# Altium project PCA_0005_FULL_CB_REV_B.PrjPcb
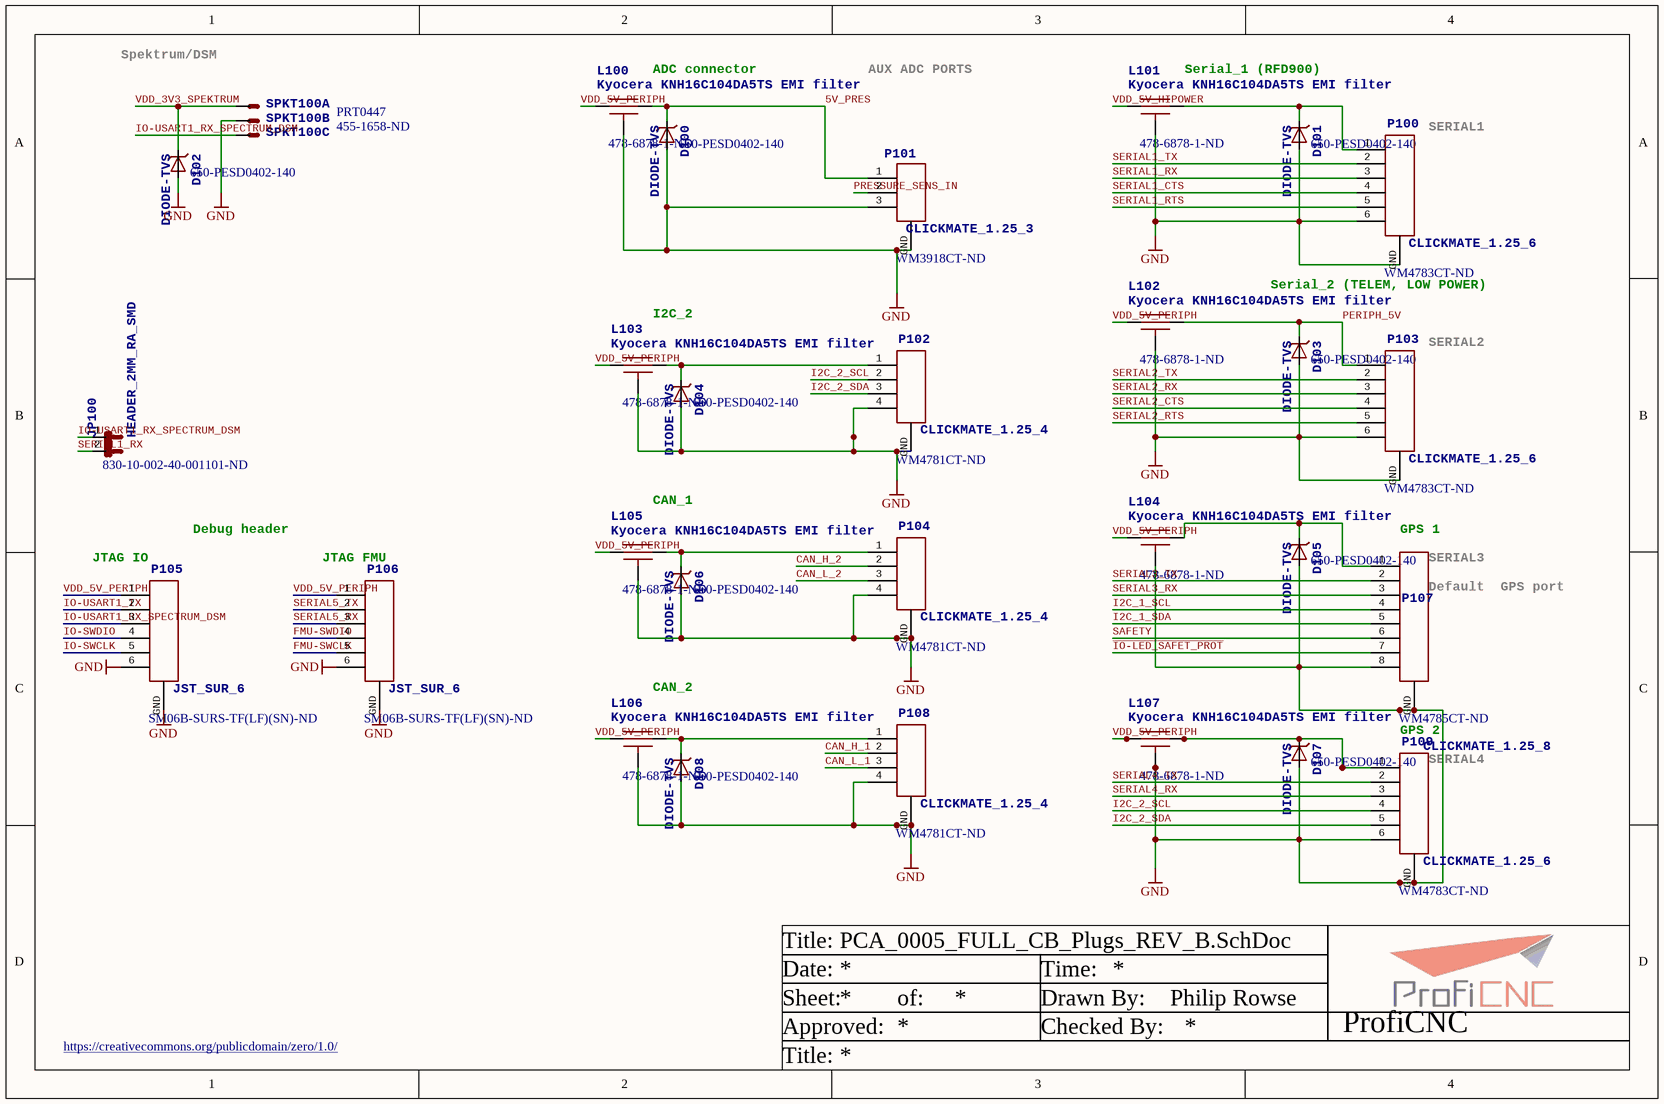
[diagram p0: PCA_0005_FULL_CB_Plugs_REV_B.SchDoc]
6 sheets, 108 parts. Net scope: global (net labels, ports and power ports of the same name join across sheets).
Board file: PCA_0005_FULL_CB_REV_B.PcbDoc
Sheets:
  PCA_0005_FULL_CB_Plugs_REV_B.SchDoc
  PCA_0005_FULL_CB_Power_REV_B.SchDoc
  PCA_0005_FULL_CB_INTEL_REV_B.SchDoc
  PCA_0005_FULL_CB_Servo_REV_B.SchDoc
  PCA_0005_FULL_CB_tp_REV_B.SchDoc
  PCA_0005_FULL_CB_80_Pin_REV_B.SchDoc

## Sheet PCA_0005_FULL_CB_Plugs_REV_B.SchDoc
size A4; DrawnBy: Philip Rowse

### Parts
D100  DIODE-TVS  Supplier Part Number 1: 650-PESD0402-140  [0402-TVS]
D101  DIODE-TVS  Supplier Part Number 1: 650-PESD0402-140  [0402-TVS]
D102  DIODE-TVS  Supplier Part Number 1: 650-PESD0402-140  [0402-TVS]
D103  DIODE-TVS  Supplier Part Number 1: 650-PESD0402-140  [0402-TVS]
D104  DIODE-TVS  Supplier Part Number 1: 650-PESD0402-140  [0402-TVS]
D105  DIODE-TVS  Supplier Part Number 1: 650-PESD0402-140  [0402-TVS]
D106  DIODE-TVS  Supplier Part Number 1: 650-PESD0402-140  [0402-TVS]
D107  DIODE-TVS  Supplier Part Number 1: 650-PESD0402-140  [0402-TVS]
D108  DIODE-TVS  Supplier Part Number 1: 650-PESD0402-140  [0402-TVS]
JP100  HEADER_2MM_RA_SMD  Supplier Part Number 1: 830-10-002-40-001101-ND  [HEADER_2MM_RA_2]
L100  Kyocera KNH16C104DA5TS EMI filter  Supplier Part Number 1: 478-6878-1-ND  [KYOCERA-KNH16-DA]
L101  Kyocera KNH16C104DA5TS EMI filter  Supplier Part Number 1: 478-6878-1-ND  [KYOCERA-KNH16-DA]
L102  Kyocera KNH16C104DA5TS EMI filter  Supplier Part Number 1: 478-6878-1-ND  [KYOCERA-KNH16-DA]
L103  Kyocera KNH16C104DA5TS EMI filter  Supplier Part Number 1: 478-6878-1-ND  [KYOCERA-KNH16-DA]
L104  Kyocera KNH16C104DA5TS EMI filter  Supplier Part Number 1: 478-6878-1-ND  [KYOCERA-KNH16-DA]
L105  Kyocera KNH16C104DA5TS EMI filter  Supplier Part Number 1: 478-6878-1-ND  [KYOCERA-KNH16-DA]
L106  Kyocera KNH16C104DA5TS EMI filter  Supplier Part Number 1: 478-6878-1-ND  [KYOCERA-KNH16-DA]
L107  Kyocera KNH16C104DA5TS EMI filter  Supplier Part Number 1: 478-6878-1-ND  [KYOCERA-KNH16-DA]
P100  CLICKMATE_1.25_6  Supplier Part Number 1: WM4783CT-ND  [CLICKMATE_V6]
P101  CLICKMATE_1.25_3  Supplier Part Number 1: WM3918CT-ND  [CLICKMATE_V3]
P102  CLICKMATE_1.25_4  Supplier Part Number 1: WM4781CT-ND  [CLICKMATE_V4]
P103  CLICKMATE_1.25_6  Supplier Part Number 1: WM4783CT-ND  [CLICKMATE_V6]
P104  CLICKMATE_1.25_4  Supplier Part Number 1: WM4781CT-ND  [CLICKMATE_V4]
P105  JST_SUR_6  Supplier Part Number 1: SM06B-SURS-TF(LF)(SN)-ND  [JST_SUR_H6]
P106  JST_SUR_6  Supplier Part Number 1: SM06B-SURS-TF(LF)(SN)-ND  [JST_SUR_H6]
P107  CLICKMATE_1.25_8  Supplier Part Number 1: WM4785CT-ND  [CLICKMATE_V8]
P108  CLICKMATE_1.25_4  Supplier Part Number 1: WM4781CT-ND  [CLICKMATE_V4]
P109  CLICKMATE_1.25_6  Supplier Part Number 1: WM4783CT-ND  [CLICKMATE_V6]
SPKT100  CONN_SPEKTRUM_RX-TH  [B3B-ZR]  (value not drawn)  (parts A,B,C of 3)

### Nets
GND: D100.A D101.A D102.A D103.A D104.A D105.A D106.A D107.A D108.A L100.GND L101.GND L102.GND L103.GND L104.GND L105.GND L106.GND L107.GND P100.6 P100.GND P101.3 P101.GND P102.4 P102.GND P103.6 P103.GND P104.4 P104.GND P105.6 P105.GND P106.6 P106.GND P107.8 P107.GND P108.4 P108.GND P109.6 P109.GND SPKT100.2(S)
5V_PRES: D100.C L100.P$2 P101.1
CAN_H_1: P108.2
CAN_H_2: P104.2
CAN_L_1: P108.3
CAN_L_2: P104.3
FMU-SWCLK: P106.5
FMU-SWDIO: P106.4
I2C_1_SCL: P107.4
I2C_1_SDA: P107.5
I2C_2_SCL: P102.2 P109.4
I2C_2_SDA: P102.3 P109.5
~{IO-LED_SAFET_PROT}: P107.7
IO-SWCLK: P105.5
IO-SWDIO: P105.4
IO-USART1_RX_SPECTRUM_DSM: JP100.1 P105.3 SPKT100.1(S)
IO-USART1_TX: P105.2
PERIPH_5V: D103.C L102.P$2 P103.1
PRESSURE_SENS_IN: P101.2
SAFETY: P107.6
SERIAL1_CTS: P100.4
SERIAL1_RTS: P100.5
SERIAL1_RX: JP100.2 P100.3
SERIAL1_TX: P100.2
SERIAL2_CTS: P103.4
SERIAL2_RTS: P103.5
SERIAL2_RX: P103.3
SERIAL2_TX: P103.2
SERIAL3_RX: P107.3
SERIAL3_TX: P107.2
SERIAL4_RX: P109.3
SERIAL4_TX: P109.2
SERIAL5_RX: P106.3
SERIAL5_TX: P106.2
VDD_3V3_SPEKTRUM: D102.C SPKT100.3(S)
VDD_5V_HIPOWER: L101.P$1
VDD_5V_PERIPH: L100.P$1 L102.P$1 L103.P$1 L104.P$1 L105.P$1 L106.P$1 L107.P$1 P105.1 P106.1
NetD101_C: D101.C L101.P$2 P100.1
NetD104_C: D104.C L103.P$2 P102.1
NetD105_C: D105.C L104.P$2 P107.1
NetD106_C: D106.C L105.P$2 P104.1
NetD107_C: D107.C L107.P$2 P109.1
NetD108_C: D108.C L106.P$2 P108.1

### Notes on the sheet
- Spektrum/DSM
- (near L100) ADC connector
- AUX ADC PORTS
- (near L101) Serial_1 (RFD900)
- (near P100) SERIAL1
- (near L103) I2C_2
- Serial_2 (TELEM, LOW POWER)
- (near P103) SERIAL2
- Debug header
- (near L105) CAN_1
- (near P107) GPS 1
- (near P105) JTAG IO
- (near P106) JTAG FMU
- (near P107) SERIAL3
- (near P107) Default
  GPS port
- (near L106) CAN_2
- GPS 2
- (near P109) SERIAL4
- Title:
- Date:
- Time:
- https://creativecommons.org/publicdomain/zero/1.0/
- Sheet:
- Approved:
- of:
- Drawn By:
- Checked By:
- ProfiCNC

### Library data of the parts
D100-D108 = DIODE-TVS: Diode, TVS, 14VWM, 40VC, 0402, SMD; 3DR_PARTNO: ECM0837; Supplier 1: Mouser
JP100 = HEADER_2MM_RA_SMD: Connector, PCB, 2MM, 2Pos, R/A, SMD, Au; PARTNO: 830-10-002-40-001101; 3DR_PARTNO: PRT0437; Supplier 1: Digi-Key
L100-L107 = KNH16C104DA5TS: Capacitor, Filter, 0.1uF, 25V, 2A, 0603, SMD; 3DR_PARTNO: ECM0719; Supplier 1: Digi-Key
P100 P103 P109 = CLICKMATE_1.25_6: Connector, Rcpt, 6Pos, 1.25MM, W/B, VERT, SMD, Tin; 3DR_PARTNO: PRT0439; Supplier 1: Digi-Key
P101 = CLICKMATE_1.25_3: Connector, Rcpt,1.25MM,W/B,SGL,S/T,3CKT,SMD,Tin; 3DR_PARTNO: PRT0440; Supplier 1: Digi-Key
P102 P104 P108 = CLICKMATE_1.25_4: Connector, Rcpt, 4Pos, 1.25MM, W/B, VERT, SMD, Tin; 3DR_PARTNO: PRT0441; Supplier 1: Digi-Key
P105 P106 = JST_SUR_6: Connector, Header, 6Pos, .8mm IDC, R/A, SMD, Tin; 3DR_PARTNO: PRT0442; Supplier 1: Digi-Key
P107 = CLICKMATE_1.25_8: Connector, Rcpt, 8Pos, 1.25MM, W/B, VERT, SMD, Tin; 3DR_PARTNO: PRT0443; Supplier 1: Digi-Key
SPKT100 = CONN_SPEKTRUM_RX-TH: Spektrum RX connector; JST ZH series S3B-ZR-SM4A-TF; PARTNO: B3B-ZR(LF)(SN); 3DR_PARTNO: PRT0447

## Sheet PCA_0005_FULL_CB_Power_REV_B.SchDoc
size A4; DrawnBy: Philip Rowse
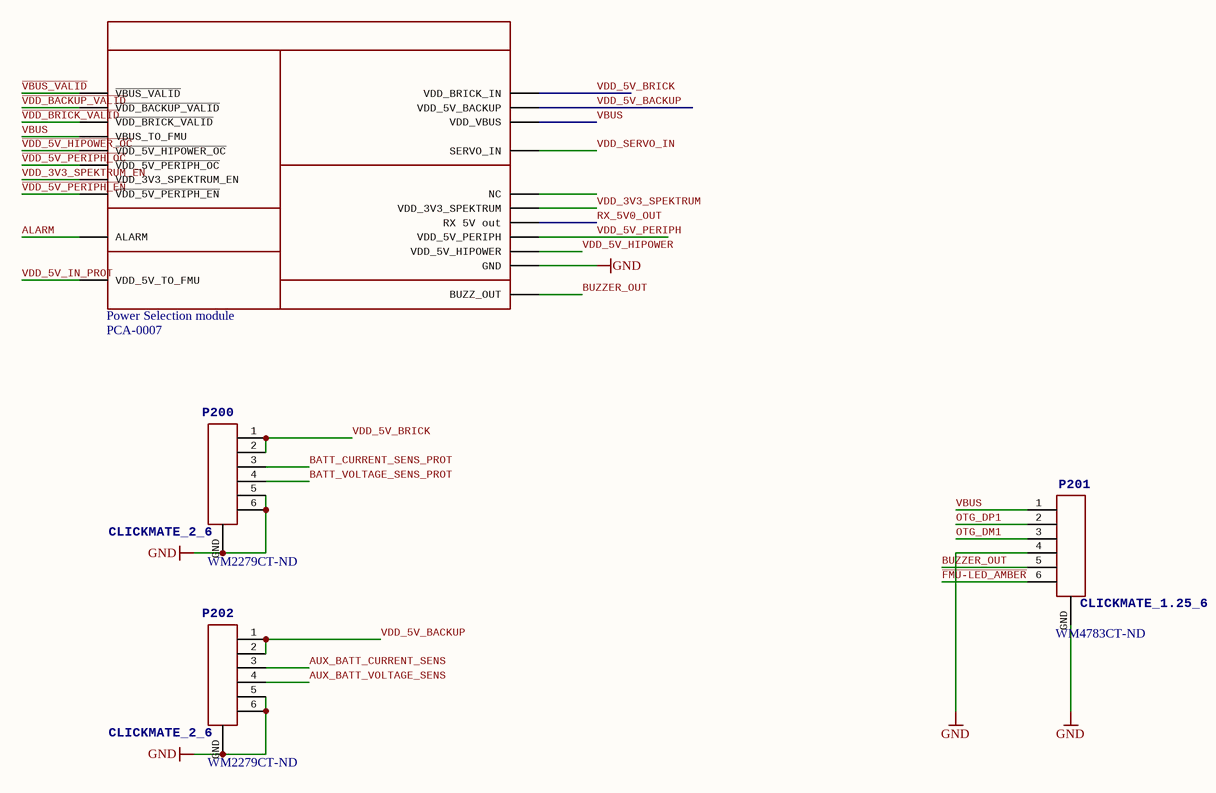
[diagram p1: PCA_0005_FULL_CB_Power_REV_B.SchDoc]

### Parts
P200  CLICKMATE_2_6  Supplier Part Number 1: WM2279CT-ND  [CLICKMATE_V6_2MM]
P201  CLICKMATE_1.25_6  Supplier Part Number 1: WM4783CT-ND  [CLICKMATE_V6]
P202  CLICKMATE_2_6  Supplier Part Number 1: WM2279CT-ND  [CLICKMATE_V6_2MM]
PSM200  Power Selection module  Supplier Part Number 1: PCA-0007  [PSM]

### Nets
GND: P200.5 P200.6 P200.GND P201.4 P201.GND P202.5 P202.6 P202.GND PSM200.GND
ALARM: PSM200.ALARM
AUX_BATT_CURRENT_SENS: P202.3
AUX_BATT_VOLTAGE_SENS: P202.4
BATT_CURRENT_SENS_PROT: P200.3
BATT_VOLTAGE_SENS_PROT: P200.4
BUZZER_OUT: P201.5 PSM200.BUZZER_OUT(BUZZ_OUT)
~{FMU-LED_AMBER}: P201.6
OTG_DM1: P201.3
OTG_DP1: P201.2
RX_5V0_OUT: PSM200.RX(RX_5V_out)
~{VBUS_VALID}: PSM200.!VBUS_VALID(~{VBUS_VALID})
~{VDD_5V_HIPOWER_OC}: PSM200.!VDD_5V_HIPOWER_OC(~{VDD_5V_HIPOWER_OC})
~{VDD_5V_PERIPH_EN}: PSM200.!VDD_5V_PERIPH_EN(~{VDD_5V_PERIPH_EN})
~{VDD_5V_PERIPH_OC}: PSM200.!VDD_5V_PERIPH_OC(~{VDD_5V_PERIPH_OC})
~{VDD_BACKUP_VALID}: PSM200.!VDD_BACKUP_VALID(~{VDD_BACKUP_VALID})
~{VDD_BRICK_VALID}: PSM200.!VDD_BRICK_VALID(~{VDD_BRICK_VALID})
VBUS: P201.1 PSM200.VBUS(VBUS_TO_FMU) PSM200.VDD_VBUS
VDD_3V3_SPEKTRUM: PSM200.SPEK(VDD_3V3_SPEKTRUM)
VDD_3V3_SPEKTRUM_EN: PSM200.VDD_3V3_SPEKTRUM_EN
VDD_5V_BACKUP: P202.1 P202.2 PSM200.VDD_5V_BACKUP
VDD_5V_BRICK: P200.1 P200.2 PSM200.VDD_BRICK_IN
VDD_5V_HIPOWER: PSM200.5V_HIPOWER(VDD_5V_HIPOWER)
VDD_5V_IN_PROT: PSM200.VDD_5V_IN_PROT(VDD_5V_TO_FMU)
VDD_5V_PERIPH: PSM200.5V_PERIPH(VDD_5V_PERIPH)
VDD_SERVO_IN: PSM200.SERVO_IN

Not connected (* = marked no-connect by the designer): PSM200 NC

### Notes on the sheet
- Title:
- Date:
- Time:
- https://creativecommons.org/publicdomain/zero/1.0/
- Sheet:
- Approved:
- of:
- Drawn By:
- Checked By:
- ProfiCNC

### Library data of the parts
P200 P202 = CLICKMATE_2_6: Connector, Header, 6Pos, 2.54MM, Vert, THT, Au; 3DR_PARTNO: PRT0445; Supplier 1: Digi-Key
P201 = CLICKMATE_1.25_6: as P100 on sheet PCA_0005_FULL_CB_Plugs_REV_B; Supplier 1: Digi-Key
PSM200 = PSMPSM: PCA, PSM, PX4, Assembly; Manufacturer 1: 3DR; Mfg Part Num (Alternate): DO NOT SWAP; 3DR_PARTNO: PCA0007; Supplier 1: 3DR; Supplier Unit Price 1: 17; Manufacturer Part Number 1: PCA-0007; Supplier Currency 1: USD; Supplier Order Qty 1: 100

## Sheet PCA_0005_FULL_CB_INTEL_REV_B.SchDoc
size A4; DrawnBy: Philip Rowse
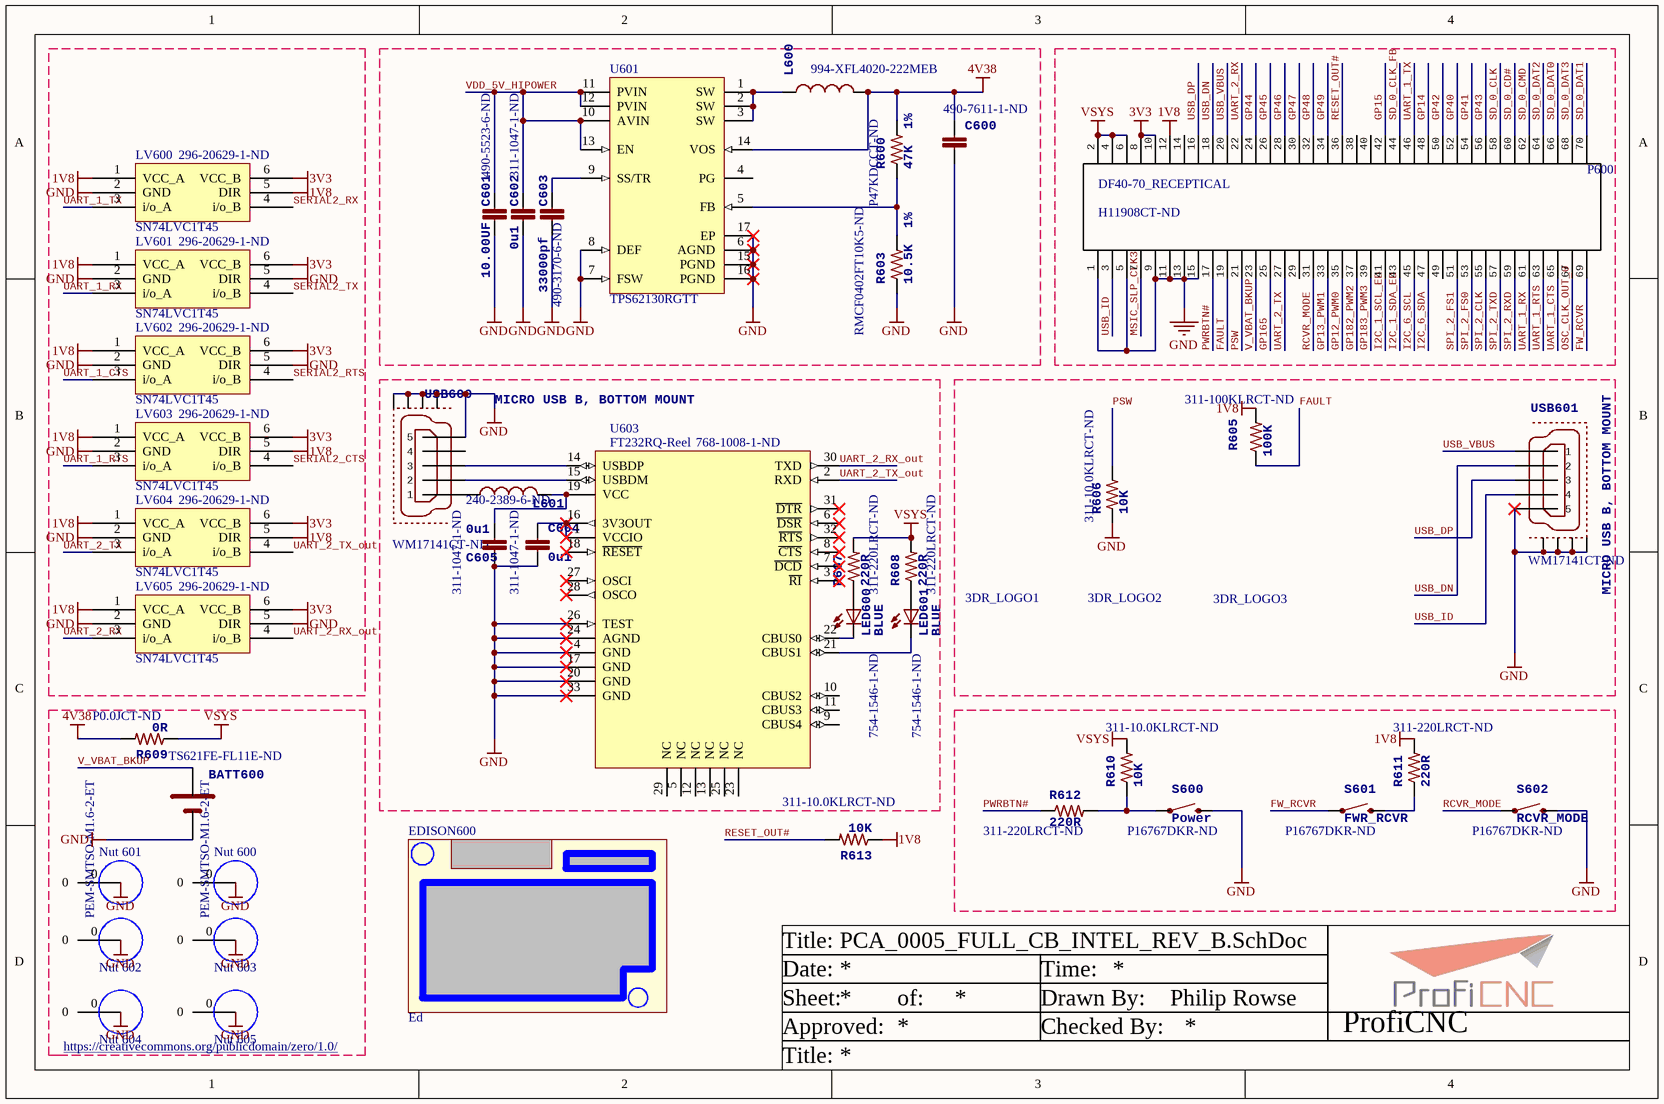
[diagram p2: PCA_0005_FULL_CB_INTEL_REV_B.SchDoc]

### Parts
3DR_LOGO1  (no value)  [3DR_Small]
3DR_LOGO2  (no value)  [3DR_smaller]
3DR_LOGO3  (no value)  [3DR_smaller]
BATT600  Supplier Part Number 1: TS621FE-FL11E-ND  [MS621FE]
C600  Supplier Part Number 1: 490-7611-1-ND  [0603-CAP]
C601  10.00UF  Supplier Part Number 1: 490-5523-6-ND  [0805-CAP]
C602  0u1  Supplier Part Number 1: 311-1047-1-ND  [0402-CAP]
C603  33000pf  Supplier Part Number 1: 490-3170-6-ND  [0402-CAP]
C604  0u1  Supplier Part Number 1: 311-1047-1-ND  [0402-CAP]
C605  0u1  Supplier Part Number 1: 311-1047-1-ND  [0402-CAP]
EDISON600  Ed  [ed]
L600  Supplier Part Number 1: 994-XFL4020-222MEB  [XFL4020]  (hidden comment: XFL4020-222MEB)
L601  Supplier Part Number 1: 240-2389-6-ND  [0805-IND]
LED600  BLUE  Supplier Part Number 1: 754-1546-1-ND  [0603-LED-Blue]
LED601  BLUE  Supplier Part Number 1: 754-1546-1-ND  [0603-LED-Blue]
LV600  SN74LVC1T45  Supplier Part Number 1: 296-20629-1-ND  [DRL]
LV601  SN74LVC1T45  Supplier Part Number 1: 296-20629-1-ND  [DRL]
LV602  SN74LVC1T45  Supplier Part Number 1: 296-20629-1-ND  [DRL]
LV603  SN74LVC1T45  Supplier Part Number 1: 296-20629-1-ND  [DRL]
LV604  SN74LVC1T45  Supplier Part Number 1: 296-20629-1-ND  [DRL]
LV605  SN74LVC1T45  Supplier Part Number 1: 296-20629-1-ND  [DRL]
Nut_600  PEM-SMTSO-M1.6-2-ET  [PEM-SMTSO-M1.6-2-ET]
Nut_601  PEM-SMTSO-M1.6-2-ET  [PEM-SMTSO-M1.6-2-ET]
Nut_602  PEM-SMTSO-M1.6-2-ET  [PEM-SMTSO-M1.6-2-ET]  (value not drawn)
Nut_603  PEM-SMTSO-M1.6-2-ET  [PEM-SMTSO-M1.6-2-ET]  (value not drawn)
Nut_604  PEM-SMTSO-M1.6-2-ET  [PEM-SMTSO-M1.6-2-ET]  (value not drawn)
Nut_605  PEM-SMTSO-M1.6-2-ET  [PEM-SMTSO-M1.6-2-ET]  (value not drawn)
P600  DF40-70_RECEPTICAL  Supplier Part Number 1: H11908CT-ND  [DF40-70_RECEPTICAL]
R600  47K  1%  Supplier Part Number 1: P47KDCCT-ND  [0402-RES]
R603  10.5K  1%  Supplier Part Number 1: RMCF0402FT10K5-ND  [0402-RES]
R605  100K  Supplier Part Number 1: 311-100KLRCT-ND  [0402-RES]
R606  10K  Supplier Part Number 1: 311-10.0KLRCT-ND  [0402-RES]
R607  220R  Supplier Part Number 1: 311-220LRCT-ND  [0402-RES]
R608  220R  Supplier Part Number 1: 311-220LRCT-ND  [0402-RES]
R609  0R  Supplier Part Number 1: P0.0JCT-ND  [0402-RES]
R610  10K  Supplier Part Number 1: 311-10.0KLRCT-ND  [0402-RES]
R611  220R  Supplier Part Number 1: 311-220LRCT-ND  [0402-RES]
R612  220R  Supplier Part Number 1: 311-220LRCT-ND  [0402-RES]
R613  10K  Supplier Part Number 1: 311-10.0KLRCT-ND  [0402-RES]
S600  Power  Supplier Part Number 1: P16767DKR-ND  [EVQP7J01K]
S601  FWR_RCVR  Supplier Part Number 1: P16767DKR-ND  [EVQP7J01K]
S602  RCVR_MODE  Supplier Part Number 1: P16767DKR-ND  [EVQP7J01K]
U601  TPS62130RGTT  [RGT16-1700X1700TP]
U603  FT232RQ-Reel  Supplier Part Number 1: 768-1008-1-ND  [PQFN5X5-32_V]
USB600  MICRO USB B, BOTTOM MOUNT  Supplier Part Number 1: WM17141CT-ND  [MOLEX-47346-0001]
USB601  MICRO USB B, BOTTOM MOUNT  Supplier Part Number 1: WM17141CT-ND  [MOLEX-47346-0001]

### Nets
1V8: LV600.1(VCC_A) LV600.5(DIR) LV601.1(VCC_A) LV602.1(VCC_A) LV603.1(VCC_A) LV603.5(DIR) LV604.1(VCC_A) LV604.5(DIR) LV605.1(VCC_A) P600.12(P$12) R605.P$2 R611.P$2 R613.P$1
3V3: LV600.6(VCC_B) LV601.6(VCC_B) LV602.6(VCC_B) LV603.6(VCC_B) LV604.6(VCC_B) LV605.6(VCC_B) P600.8(P$8) P600.10(P$10)
4V38: C600.P$1 L600.P$2 R600.P$2 R609.P$2 U601.14(VOS)
GND: BATT600.2(NEG) C600.P$2 C601.P$2 C602.P$2 C603.P$2 C604.P$2 C605.P$2 LV600.2(GND) LV601.2(GND) LV601.5(DIR) LV602.2(GND) LV602.5(DIR) LV603.2(GND) LV604.2(GND) LV605.2(GND) LV605.5(DIR) Nut_600.0 Nut_601.0 Nut_602.0 Nut_603.0 Nut_604.0 Nut_605.0 P600.1(P$1) P600.5(P$5) P600.9(P$9) P600.11(P$11) P600.13(P$13) P600.15(P$15) R603.P$1 R606.P$1 S600.B3 S602.B3 U601.6(AGND) U601.7(FSW) U601.8(DEF) U601.15(PGND) U601.16(PGND) U601.17(EP) U603.4(GND) U603.17(GND) U603.20(GND) U603.24(AGND) U603.26(TEST) U603.33(GND) USB600.GND(5) USB600.GND1 USB600.GND2 USB600.GND3 USB600.GND4 USB601.GND(5) USB601.GND1 USB601.GND2 USB601.GND3 USB601.GND4
VSYS: P600.2(P$2) P600.4(P$4) P600.6(P$6) R607.P$2 R608.P$2 R609.P$1 R610.P$2
FAULT: P600.19(P$19) R605.P$1
FW_RCVR: P600.69(P$69) S601.A1
GP12_PWM0: P600.35(P$35)
GP13_PWM1: P600.33(P$33)
GP14: P600.48(P$48)
GP15: P600.42(P$42)
GP40: P600.52(P$52)
GP41: P600.54(P$54)
GP42: P600.50(P$50)
GP43: P600.56(P$56)
GP44: P600.24(P$24)
GP45: P600.26(P$26)
GP46: P600.28(P$28)
GP47: P600.30(P$30)
GP48: P600.32(P$32)
GP49: P600.34(P$34)
GP165: P600.25(P$25)
GP182_PWM2: P600.37(P$37)
GP183_PWM3: P600.39(P$39)
I2C_1_SCL_ED: P600.41(P$41)
I2C_1_SDA_ED: P600.43(P$43)
I2C_6_SCL: P600.45(P$45)
I2C_6_SDA: P600.47(P$47)
MSIC_SLP_CLK3: P600.7(P$7)
OSC_CLK_OUT_0: P600.67(P$67)
PSW: P600.21(P$21) R606.P$2
PWRBTN#: P600.17(P$17) R612.P$1
RCVR_MODE: P600.31(P$31) S602.A1
RESET_OUT#: P600.36(P$36) R613.P$2
SD_0_CD#: P600.60(P$60)
SD_0_CLK: P600.58(P$58)
SD_0_CLK_FB: P600.44(P$44)
SD_0_CMD: P600.62(P$62)
SD_0_DAT0: P600.66(P$66)
SD_0_DAT1: P600.70(P$70)
SD_0_DAT2: P600.64(P$64)
SD_0_DAT3: P600.68(P$68)
SERIAL2_CTS: LV603.4(i/o_B)
SERIAL2_RTS: LV602.4(i/o_B)
SERIAL2_RX: LV600.4(i/o_B)
SERIAL2_TX: LV601.4(i/o_B)
SPI_2_CLK: P600.55(P$55)
SPI_2_FS0: P600.53(P$53)
SPI_2_FS1: P600.51(P$51)
SPI_2_RXD: P600.59(P$59)
SPI_2_TXD: P600.57(P$57)
UART_1_CTS: LV602.3(i/o_A) P600.65(P$65)
UART_1_RTS: LV603.3(i/o_A) P600.63(P$63)
UART_1_RX: LV601.3(i/o_A) P600.61(P$61)
UART_1_TX: LV600.3(i/o_A) P600.46(P$46)
UART_2_RX: LV605.3(i/o_A) P600.22(P$22)
UART_2_RX_out: LV605.4(i/o_B) U603.30(TXD)
UART_2_TX: LV604.3(i/o_A) P600.27(P$27)
UART_2_TX_out: LV604.4(i/o_B) U603.2(RXD)
USB_DN: P600.18(P$18) USB601.D-(2)
USB_DP: P600.16(P$16) USB601.D+(3)
USB_ID: P600.3(P$3) USB601.ID(4)
USB_VBUS: P600.20(P$20) USB601.VBUS(1)
V_VBAT_BKUP: BATT600.1(POS) P600.23(P$23)
VDD_5V_HIPOWER: C601.P$1 C602.P$1 U601.10(AVIN) U601.11(PVIN) U601.12(PVIN) U601.13(EN)
NetC603_P$1: C603.P$1 U601.9(SS/TR)
NetC604_P$1: C604.P$1 U603.1(VCCIO) U603.16(3V3OUT)
NetC605_P$1: C605.P$1 L601.P$2 U603.19(VCC)
NetL600_P$1: L600.P$1 U601.1(SW) U601.2(SW) U601.3(SW)
NetL601_P$1: L601.P$1 USB600.VBUS(1)
NetLED600_A: LED600.A R607.P$1
NetLED600_C: LED600.C U603.22(CBUS0)
NetLED601_A: LED601.A R608.P$1
NetLED601_C: LED601.C U603.21(CBUS1)
NetR600_P$1: R600.P$1 R603.P$2 U601.5(FB)
NetR610_P$1: R610.P$1 R612.P$2 S600.A1
NetR611_P$1: R611.P$1 S601.B3
NetU603_14: U603.14(USBDP) USB600.D+(3)
NetU603_15: U603.15(USBDM) USB600.D-(2)

Not connected (* = marked no-connect by the designer): P600 14(P$14) 29(P$29) 38(P$38) 40(P$40) 49(P$49); U601 4(PG); U603 3(~{RI})* 5(NC) 6(~{DSR})* 7(~{DCD})* 8(~{CTS})* 9(CBUS4) 10(CBUS2) 11(CBUS3) 12(NC) 13(NC) 18(~{RESET})* 23(NC) 25(NC) 27(OSCI)* 28(OSCO)* 29(NC) 31(~{DTR})* 32(~{RTS})*; USB600 ID(4)

### Notes on the sheet
- Title:
- Date:
- Time:
- https://creativecommons.org/publicdomain/zero/1.0/
- Sheet:
- Approved:
- of:
- Drawn By:
- Checked By:
- ProfiCNC

### Library data of the parts
3DR_LOGO1-3DR_LOGO3 = 3DR_LOGO: DO NOT PLACE
BATT600 = MS621FE: MFGPN: TS621FE; DATASHEET: http://speed.sii.co.jp/data/file_PRODUCT_MASTER_50112_TITLE_IMAGESP.pdf; LINK: http://search.digikey.com/us/en/products/MS621FE-FL11E/728-1057-ND/1889208; Supplier 1: Digikey
C600 = CAP0603: Supplier 1: Digi-Key
C601 = CAP0805: CAPC,X5R,0805,10.00UF,25.00V,+/-10%; Supplier 1: Digi-Key
C602 = CAP0402: Supplier 1: Digi-Key
C603 = CAP0402: CAPC,X5R,0402,0.033UF,6.3V,+/- 10%; Supplier 1: Digi-Key
C604 C605 = CAP0402: <b>Capacitor</b> / Standard 0603 ceramic capacitor, and 0.1" leaded capacitor.; PARTNO: CC0402ZRY5V7BB104; Supplier 1: Digi-Key
L600 = INDUCTOR-XFL4020: pin to pad: P$1>1 P$2>2; PARTNUM: XFL4020-222MEB; Supplier 1: Mouser
L601 = INDUCTOR0805: Supplier 1: Digi-Key
LED600 LED601 = LED0603: <b>LEDs</b> / Standard schematic elements and footprints for 5mm, 3mm, 1206, and 0603 sized LEDs. 5mm - Spark Fun Electronics SKU : COM-00529 (and others); PARTNO: APTD1608QBC/D; Supplier 1: Digi-Key
Nut_600-Nut_605 = PEM-SMTSO-M1.6-2-ET: Fastener, M1.6x0.35mm, 8.00MM Pitch, SMTSO, CS; Mfg Part Num (Alternate): Check; Manufacturer 1: PennEngineering; 3DR_PARTNO: PRT0438; Supplier Part Number 1: PEM-SMTSO-M1.6-2-ET; Supplier 1: PennEngineering; Manufacturer Part Number 1: PEM-SMTSO-M1.6-2-ET; Supplier Unit Price 1: 0.7
R600 R603 R609 = RESISTOR0402-RES: Supplier 1: Digi-Key
R605 R606 R610-R613 = RESISTOR0402-RES: PARTNO: RC0402FR-07220RL; Supplier 1: Digi-Key
R607 R608 = RESISTOR0402-RES: <b>Resistor</b> / Basic schematic elements and footprints for 0603, 1206, and PTH 1/10th watt (small) resistors.; PARTNO: RC0402FR-07220RL; Supplier 1: Digi-Key
S600-S602 = SWITCH-MOMENTARY-2: Supplier 1: Digi-Key
U601 = TPS62130RGTT: Buck Step Down Regulator with 3 to 17 V Input and 0.9 to 6 V Output, -40 to 85 degC, 16-Pin QFN (RGT), Green (RoHS & no Sb/Br); Manufacturer: Texas Instruments; Duty Cycle(Max)(%): 100; Iout(Max)(A): 3; Iq(Typ)(mA): 0.017; Rating: Catalog; Regulated Outputs(#): 1; SubFamily: Step-Down Regulator; Switch Current Limit(Typ)(A): 4.2; Synchronous Rectification: TRUE; Vin(Max)(V): 17; Vout(Max)(V): 6; Vout(Min)(V): 0.9; DatasheetVersion: SLVSAG7; PackageVersion: revH, Oct-2011; PackageReference: RGT16-1700X1700TP; PackageDescription: 16-Pin Plastic Quad Flat No-Lead, 3 x 3 mm Body, 0.5 mm Pitch, 1.7 x 1.7 mm Exposed Pad; Supplier 1: Digi-Key; Supplier Part Number 1: 296-29934-2-ND; Supplier 2: Digi-Key; Supplier Part Number 2: 296-29934-1-ND; Supplier 3: Digi-Key; Supplier Part Number 3: 296-29934-6-ND; Supplier 4: Newark; Supplier Part Number 4: 74T5527; Supplier 5: Mouser; Supplier Part Number 5: 595-TPS62130RGTT; Eco-Plan: Green (RoHS & no Sb/Br); Topology: Buck; Vin(Min)(V): 3; Mounting Technology: Surface Mount; Code_JEDEC: MO-220; PartNumber: TPS62130RGTT; ComponentLink1Description: Datasheet; ComponentLink1URL: http://www.ti.com/general/docs/lit/getliterature.tsp?genericPartNumber=TPS62130&fileType=pdf; ComponentLink2Description: Package Specification; ComponentLink2URL: http://www.ti.com/litv/pdf/mpqf119g; ComponentLink3Description: URL Link1; ComponentLink3URL: Samples URL:http://www.ti.com/product/tps54611#samples
U603 = FT232RQ-Reel: USB UART Asynchronous Serial Data Transfer Chip, 32-pin QFN, Tape and Reel; Manufacturer: FTDI; DatasheetVersion: ver 2.10, Mar-2012; PackageVersion: Mar-12; PackageReference: PQFN5X5-32; PackageDescription: 32-Pin Quad Flat No-Lead 0.5 mm Pitch, Pullback, 3.2 x 3.2 mm Exposed Pad; PartNumber: FT232RQ-Reel; ComponentLink1Description: Manufacturer URL; ComponentLink1URL: http://www.ftdichip.com/; ComponentLink2Description: Datasheet; ComponentLink2URL: http://www.ftdichip.com/Support/Documents/DataSheets/ICs/DS_FT232R.pdf; Supplier 1: Digi-Key
USB600 USB601 = MOLEX-47346-0001: Supplier 1: Digi-Key
LV600-LV605 = SN74LVC1T45: Supplier 1: Digi-Key
P600 = DF40-70_RECEPTICAL: Supplier 1: Digi-Key

## Sheet PCA_0005_FULL_CB_Servo_REV_B.SchDoc
size A4; DrawnBy: Philip Rowse
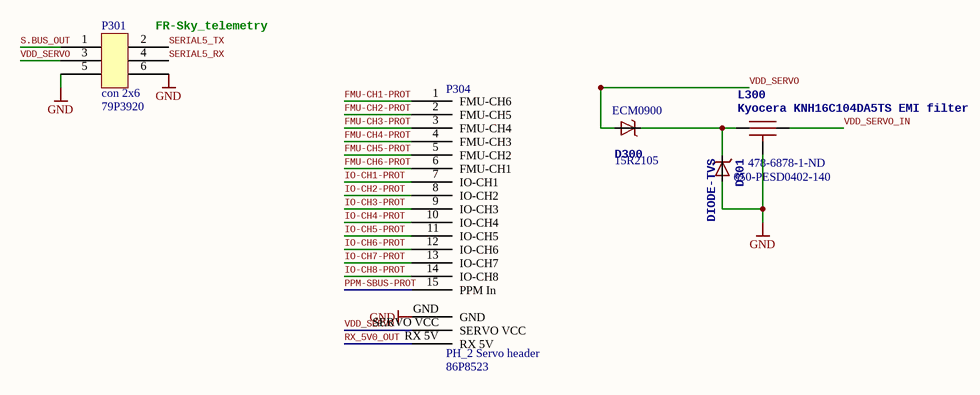
[diagram p3: PCA_0005_FULL_CB_Servo_REV_B.SchDoc]

### Parts
D300  Supplier Part Number 1: 15R2105  3DR_PARTNO: ECM0900  [MICROSMP]  (hidden comment: MSS1P4-M3)
D301  DIODE-TVS  Supplier Part Number 1: 650-PESD0402-140  [0402-TVS]
L300  Kyocera KNH16C104DA5TS EMI filter  Supplier Part Number 1: 478-6878-1-ND  [KYOCERA-KNH16-DA]
P301  con 2x6  Supplier Part Number 1: 79P3920  [TSW-103-07-G-D]
P304  PH_2 Servo header  Supplier Part Number 1: 86P8523  [TSW-115-08-G-T-RA]

### Nets
GND: D301.A L300.GND P301.5 P301.6 P304.GND
FMU-CH1-PROT: P304.1(FMU-CH6)
FMU-CH2-PROT: P304.2(FMU-CH5)
FMU-CH3-PROT: P304.3(FMU-CH4)
FMU-CH4-PROT: P304.4(FMU-CH3)
FMU-CH5-PROT: P304.5(FMU-CH2)
FMU-CH6-PROT: P304.6(FMU-CH1)
IO-CH1-PROT: P304.7(IO-CH1)
IO-CH2-PROT: P304.8(IO-CH2)
IO-CH3-PROT: P304.9(IO-CH3)
IO-CH4-PROT: P304.10(IO-CH4)
IO-CH5-PROT: P304.11(IO-CH5)
IO-CH6-PROT: P304.12(IO-CH6)
IO-CH7-PROT: P304.13(IO-CH7)
IO-CH8-PROT: P304.14(IO-CH8)
PPM-SBUS-PROT: P304.15(PPM_In)
RX_5V0_OUT: P304.RX_5V
S.BUS_OUT: P301.1
SERIAL5_RX: P301.4
SERIAL5_TX: P301.2
VDD_SERVO: D300.ANODE(A) P301.3 P304.SERVO_VCC
VDD_SERVO_IN: L300.P$2
NetD300_CATHODE: D300.CATHODE(C) D301.C L300.P$1

### Notes on the sheet
- (near P301) FR-Sky_telemetry
- Title:
- Date:
- Time:
- https://creativecommons.org/publicdomain/zero/1.0/
- Sheet:
- Approved:
- of:
- Drawn By:
- Checked By:
- ProfiCNC

### Library data of the parts
D300 = DIODE-SCHOTTKY_MSMP: Diode, Schottky, 40V, 1A, MicroSMP, SMD; Supplier 1: Newark
D301 = DIODE-TVS: as D100 on sheet PCA_0005_FULL_CB_Plugs_REV_B; Supplier 1: Mouser
L300 = KNH16C104DA5TS: as L100 on sheet PCA_0005_FULL_CB_Plugs_REV_B; Supplier 1: Digi-Key
P301 = con 2x6: Connector, Header, 6Pos, 2.54MM, Vert, THT, Au; 3DR_PARTNO: PRT0445; Supplier 1: Newark
P304 = PH_2 Servo header: Connector, Header, 45Pos, 2.54MM, R/A, THT, Tin; 3DR_PARTNO: PRT0446; Supplier 1: Newark

## Sheet PCA_0005_FULL_CB_tp_REV_B.SchDoc
size A4; DrawnBy: Philip Rowse
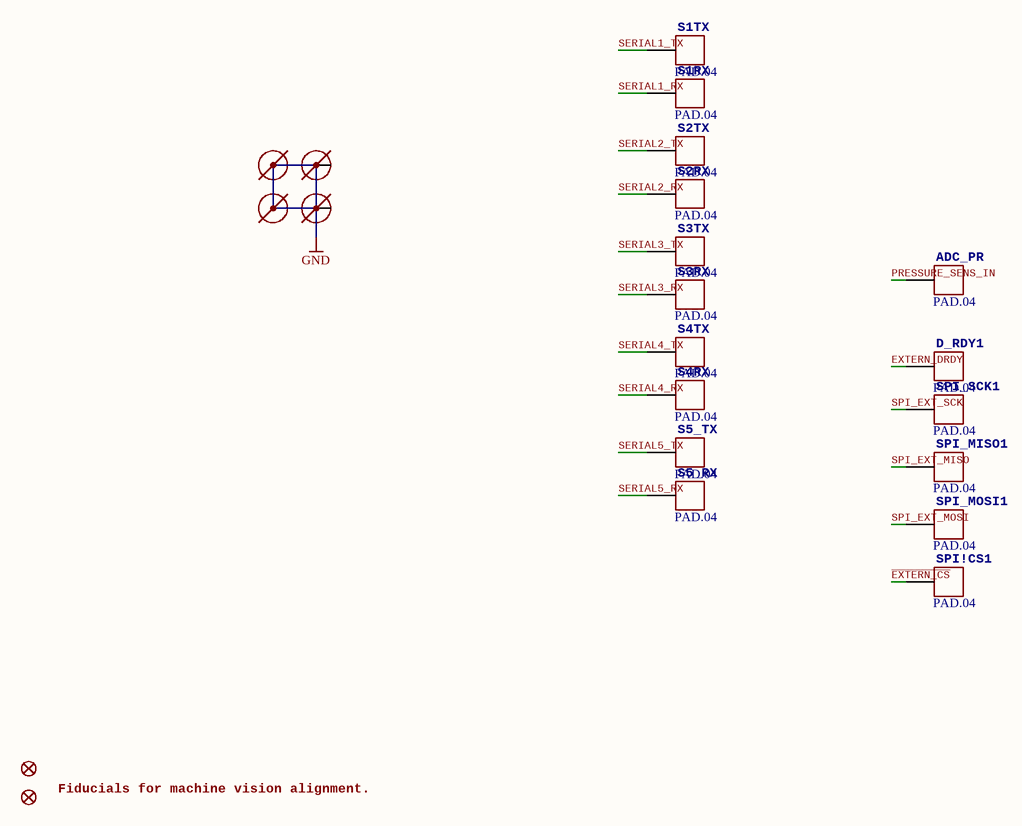
[diagram p4: PCA_0005_FULL_CB_tp_REV_B.SchDoc]

### Parts
ADC_PR  PAD.04  [PAD.04X.04]
D_RDY1  PAD.04  [PAD.04X.04]
JP400  FIDUCIAL1.5X3  [FIDUCIAL-1.5X3]  (value not drawn)
JP401  FIDUCIAL1.5X3  [FIDUCIAL-1.5X3]  (value not drawn)
M3_MOUNT901  MOUNT-HOLE1.8MM  [MOUNT-HOLE1.8]  (value not drawn)
M3_MOUNT902  MOUNT-HOLE1.8MM  [MOUNT-HOLE1.8]  (value not drawn)
M3_MOUNT903  MOUNT-HOLE1.8MM  [MOUNT-HOLE1.8]  (value not drawn)
M3_MOUNT904  MOUNT-HOLE1.8MM  [MOUNT-HOLE1.8]  (value not drawn)
S1RX  PAD.04  [PAD.04X.04]
S1TX  PAD.04  [PAD.04X.04]
S2RX  PAD.04  [PAD.04X.04]
S2TX  PAD.04  [PAD.04X.04]
S3RX  PAD.04  [PAD.04X.04]
S3TX  PAD.04  [PAD.04X.04]
S4RX  PAD.04  [PAD.04X.04]
S4TX  PAD.04  [PAD.04X.04]
S5_RX  PAD.04  [PAD.04X.04]
S5_TX  PAD.04  [PAD.04X.04]
SPI!CS1  PAD.04  [PAD.04X.04]
SPI_MISO1  PAD.04  [PAD.04X.04]
SPI_MOSI1  PAD.04  [PAD.04X.04]
SPI_SCK1  PAD.04  [PAD.04X.04]

### Nets
GND: M3_MOUNT901.1 M3_MOUNT902.1 M3_MOUNT903.1 M3_MOUNT904.1
~{EXTERN_CS}: SPI!CS1.P$1
EXTERN_DRDY: D_RDY1.P$1
PRESSURE_SENS_IN: ADC_PR.P$1
SERIAL1_RX: S1RX.P$1
SERIAL1_TX: S1TX.P$1
SERIAL2_RX: S2RX.P$1
SERIAL2_TX: S2TX.P$1
SERIAL3_RX: S3RX.P$1
SERIAL3_TX: S3TX.P$1
SERIAL4_RX: S4RX.P$1
SERIAL4_TX: S4TX.P$1
SERIAL5_RX: S5_RX.P$1
SERIAL5_TX: S5_TX.P$1
SPI_EXT_MISO: SPI_MISO1.P$1
SPI_EXT_MOSI: SPI_MOSI1.P$1
SPI_EXT_SCK: SPI_SCK1.P$1

### Notes on the sheet
- Fiducials for machine
  vision alignment.
- Title:
- Date:
- Time:
- https://creativecommons.org/publicdomain/zero/1.0/
- Sheet:
- Approved:
- of:
- Drawn By:
- Checked By:
- ProfiCNC

### Library data of the parts
ADC_PR D_RDY1 S1RX S1TX S2RX S2TX S3RX S3TX S4RX S4TX S5_RX S5_TX SPI!CS1 SPI_MISO1 SPI_MOSI1 SPI_SCK1 = PAD.04: Manufacturer 1: DNF; Supplier Unit Price 1: 0; Supplier 1: DNF; Supplier Part Number 1: DNF
JP400 JP401 = FIDUCIAL1.5X3: <b>Fiducial Alignment Points</b> / Various fiducial points for machine vision alignment.; BOM: EXCLUDE; PARTNO: *

## Sheet PCA_0005_FULL_CB_80_Pin_REV_B.SchDoc
size A4; DrawnBy: Philip Rowse
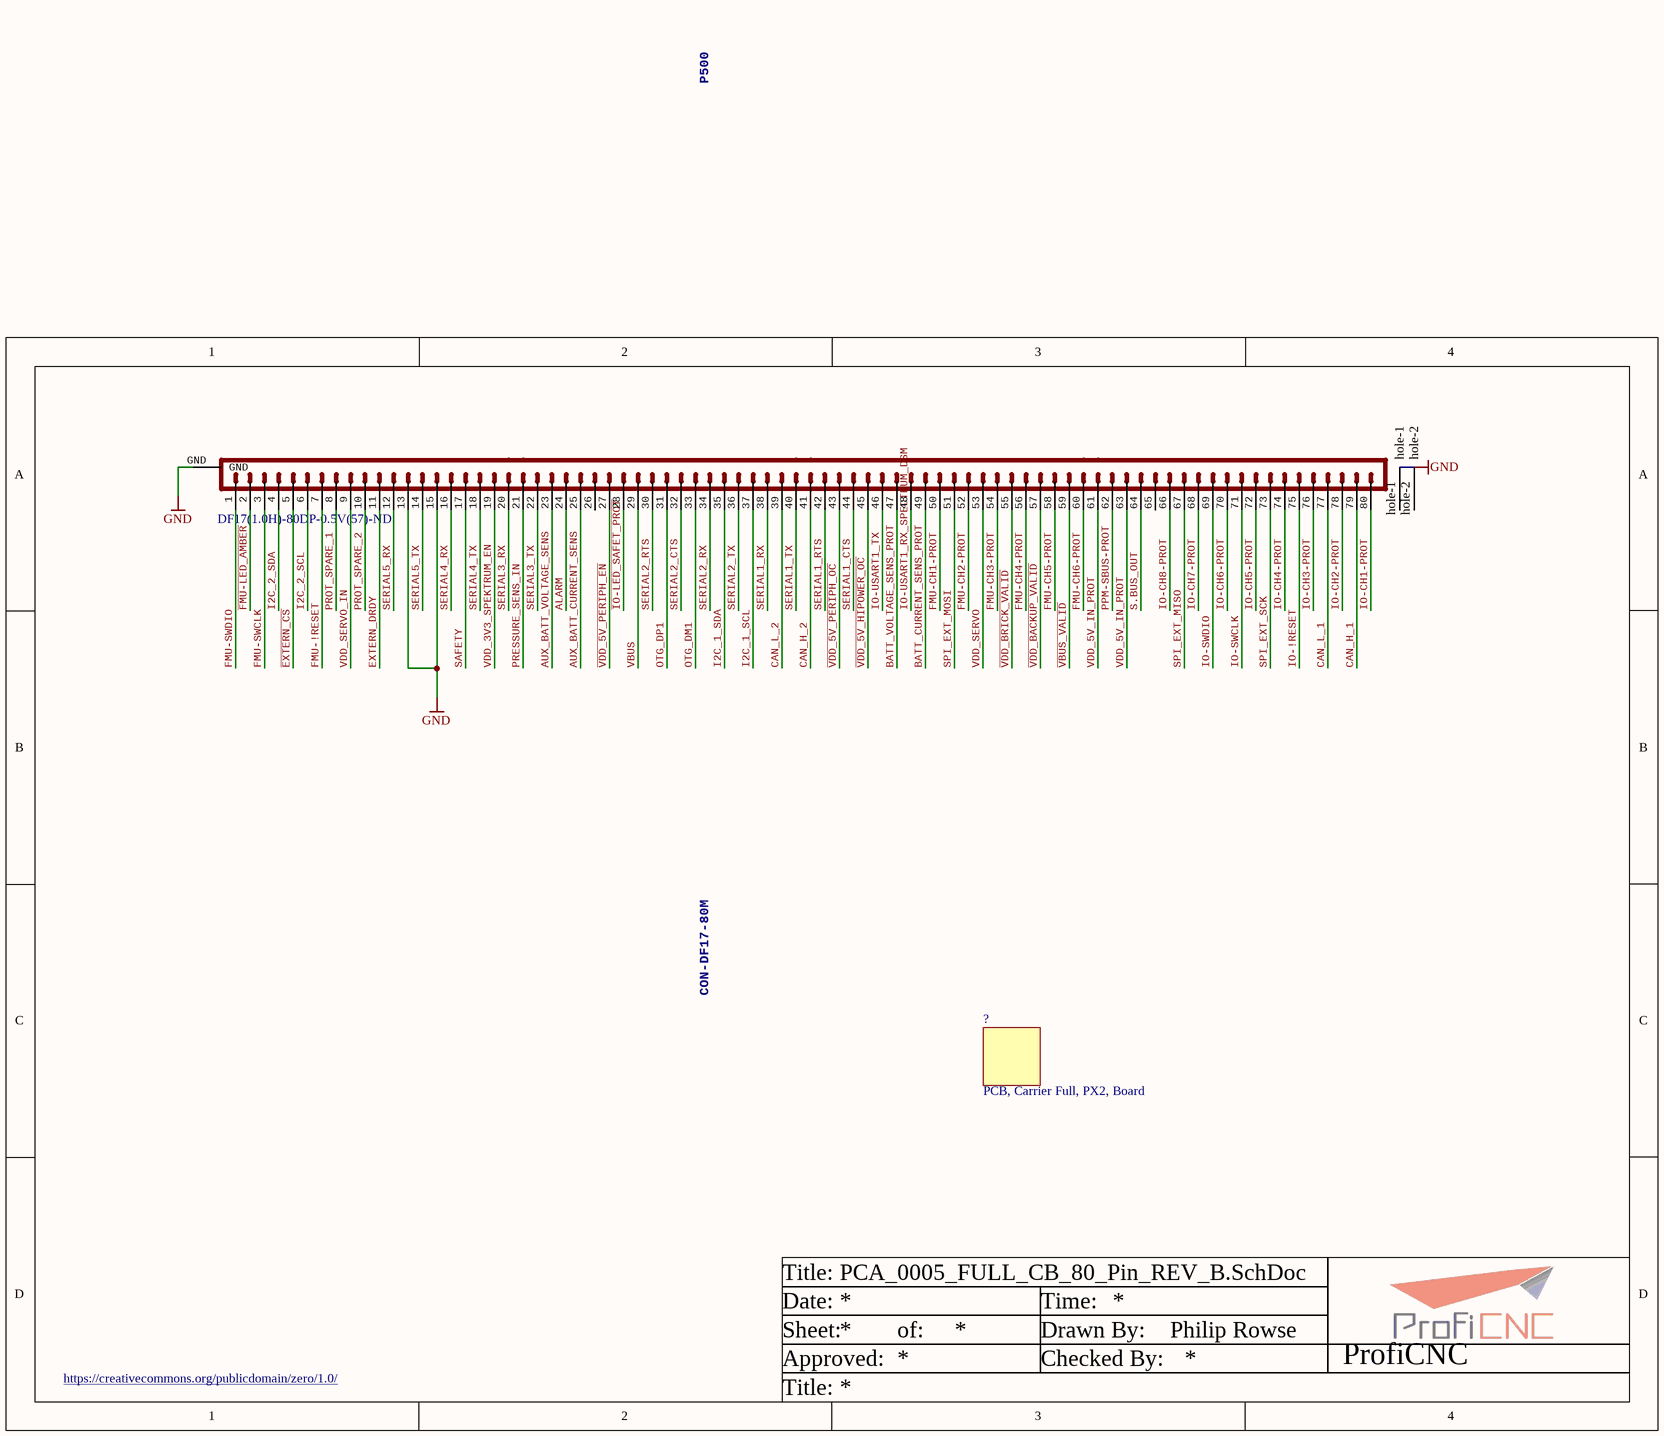
[diagram p5: PCA_0005_FULL_CB_80_Pin_REV_B.SchDoc]

### Parts
?  PCB, Carrier Full, PX2, Board
P500  CON-DF17-80M  Supplier Part Number 1: DF17(1.0H)-80DP-0.5V(57)-ND  [CON-DF17-80M]

### Nets
GND: P500.13 P500.15 P500.GND
ALARM: P500.24
AUX_BATT_CURRENT_SENS: P500.25
AUX_BATT_VOLTAGE_SENS: P500.23
BATT_CURRENT_SENS_PROT: P500.49
BATT_VOLTAGE_SENS_PROT: P500.47
CAN_H_1: P500.79
CAN_H_2: P500.41
CAN_L_1: P500.77
CAN_L_2: P500.39
~{EXTERN_CS}: P500.5
EXTERN_DRDY: P500.11
~{FMU-LED_AMBER}: P500.2
FMU-!RESET: P500.7
FMU-CH1-PROT: P500.50
FMU-CH2-PROT: P500.52
FMU-CH3-PROT: P500.54
FMU-CH4-PROT: P500.56
FMU-CH5-PROT: P500.58
FMU-CH6-PROT: P500.60
FMU-SWCLK: P500.3
FMU-SWDIO: P500.1
I2C_1_SCL: P500.37
I2C_1_SDA: P500.35
I2C_2_SCL: P500.6
I2C_2_SDA: P500.4
~{IO-LED_SAFET_PROT}: P500.28
IO-!RESET: P500.75
IO-CH1-PROT: P500.80
IO-CH2-PROT: P500.78
IO-CH3-PROT: P500.76
IO-CH4-PROT: P500.74
IO-CH5-PROT: P500.72
IO-CH6-PROT: P500.70
IO-CH7-PROT: P500.68
IO-CH8-PROT: P500.66
IO-SWCLK: P500.71
IO-SWDIO: P500.69
IO-USART1_RX_SPECTRUM_DSM: P500.48
IO-USART1_TX: P500.46
OTG_DM1: P500.33
OTG_DP1: P500.31
PPM-SBUS-PROT: P500.62
PRESSURE_SENS_IN: P500.21
PROT_SPARE_1: P500.8
PROT_SPARE_2: P500.10
S.BUS_OUT: P500.64
SAFETY: P500.17
SERIAL1_CTS: P500.44
SERIAL1_RTS: P500.42
SERIAL1_RX: P500.38
SERIAL1_TX: P500.40
SERIAL2_CTS: P500.32
SERIAL2_RTS: P500.30
SERIAL2_RX: P500.34
SERIAL2_TX: P500.36
SERIAL3_RX: P500.20
SERIAL3_TX: P500.22
SERIAL4_RX: P500.16
SERIAL4_TX: P500.18
SERIAL5_RX: P500.12
SERIAL5_TX: P500.14
SPI_EXT_MISO: P500.67
SPI_EXT_MOSI: P500.51
SPI_EXT_SCK: P500.73
~{VBUS_VALID}: P500.59
~{VDD_5V_HIPOWER_OC}: P500.45
~{VDD_5V_PERIPH_EN}: P500.27
~{VDD_5V_PERIPH_OC}: P500.43
~{VDD_BACKUP_VALID}: P500.57
~{VDD_BRICK_VALID}: P500.55
VBUS: P500.29
VDD_3V3_SPEKTRUM_EN: P500.19
VDD_5V_IN_PROT: P500.61 P500.63
VDD_SERVO: P500.53
VDD_SERVO_IN: P500.9

Not connected (* = marked no-connect by the designer): P500 26 65 hole-1 hole-2

### Notes on the sheet
- Title:
- Date:
- Time:
- https://creativecommons.org/publicdomain/zero/1.0/
- Sheet:
- Approved:
- of:
- Drawn By:
- Checked By:
- ProfiCNC

### Library data of the parts
? = PCB0006: 3DR_PARTNO: PCB0006
P500 = CON-DF17-80M: Connector, Header, 80Pos, .5MM, DUAL, SMD, Au; 3DR_PARTNO: PRT0436; Supplier 1: Digi-Key

## Nets that join several sheets
GND: PCA_0005_FULL_CB_Plugs_REV_B (38 pins), PCA_0005_FULL_CB_Power_REV_B (9 pins), PCA_0005_FULL_CB_INTEL_REV_B (54 pins), PCA_0005_FULL_CB_Servo_REV_B (5 pins), PCA_0005_FULL_CB_tp_REV_B (M3_MOUNT901.1 M3_MOUNT902.1 M3_MOUNT903.1 M3_MOUNT904.1), PCA_0005_FULL_CB_80_Pin_REV_B (P500.13 P500.15 P500.GND)
ALARM: PCA_0005_FULL_CB_Power_REV_B (PSM200.ALARM), PCA_0005_FULL_CB_80_Pin_REV_B (P500.24)
AUX_BATT_CURRENT_SENS: PCA_0005_FULL_CB_Power_REV_B (P202.3), PCA_0005_FULL_CB_80_Pin_REV_B (P500.25)
AUX_BATT_VOLTAGE_SENS: PCA_0005_FULL_CB_Power_REV_B (P202.4), PCA_0005_FULL_CB_80_Pin_REV_B (P500.23)
BATT_CURRENT_SENS_PROT: PCA_0005_FULL_CB_Power_REV_B (P200.3), PCA_0005_FULL_CB_80_Pin_REV_B (P500.49)
BATT_VOLTAGE_SENS_PROT: PCA_0005_FULL_CB_Power_REV_B (P200.4), PCA_0005_FULL_CB_80_Pin_REV_B (P500.47)
CAN_H_1: PCA_0005_FULL_CB_Plugs_REV_B (P108.2), PCA_0005_FULL_CB_80_Pin_REV_B (P500.79)
CAN_H_2: PCA_0005_FULL_CB_Plugs_REV_B (P104.2), PCA_0005_FULL_CB_80_Pin_REV_B (P500.41)
CAN_L_1: PCA_0005_FULL_CB_Plugs_REV_B (P108.3), PCA_0005_FULL_CB_80_Pin_REV_B (P500.77)
CAN_L_2: PCA_0005_FULL_CB_Plugs_REV_B (P104.3), PCA_0005_FULL_CB_80_Pin_REV_B (P500.39)
~{EXTERN_CS}: PCA_0005_FULL_CB_tp_REV_B (SPI!CS1.P$1), PCA_0005_FULL_CB_80_Pin_REV_B (P500.5)
EXTERN_DRDY: PCA_0005_FULL_CB_tp_REV_B (D_RDY1.P$1), PCA_0005_FULL_CB_80_Pin_REV_B (P500.11)
~{FMU-LED_AMBER}: PCA_0005_FULL_CB_Power_REV_B (P201.6), PCA_0005_FULL_CB_80_Pin_REV_B (P500.2)
FMU-CH1-PROT: PCA_0005_FULL_CB_Servo_REV_B (P304.1), PCA_0005_FULL_CB_80_Pin_REV_B (P500.50)
FMU-CH2-PROT: PCA_0005_FULL_CB_Servo_REV_B (P304.2), PCA_0005_FULL_CB_80_Pin_REV_B (P500.52)
FMU-CH3-PROT: PCA_0005_FULL_CB_Servo_REV_B (P304.3), PCA_0005_FULL_CB_80_Pin_REV_B (P500.54)
FMU-CH4-PROT: PCA_0005_FULL_CB_Servo_REV_B (P304.4), PCA_0005_FULL_CB_80_Pin_REV_B (P500.56)
FMU-CH5-PROT: PCA_0005_FULL_CB_Servo_REV_B (P304.5), PCA_0005_FULL_CB_80_Pin_REV_B (P500.58)
FMU-CH6-PROT: PCA_0005_FULL_CB_Servo_REV_B (P304.6), PCA_0005_FULL_CB_80_Pin_REV_B (P500.60)
FMU-SWCLK: PCA_0005_FULL_CB_Plugs_REV_B (P106.5), PCA_0005_FULL_CB_80_Pin_REV_B (P500.3)
FMU-SWDIO: PCA_0005_FULL_CB_Plugs_REV_B (P106.4), PCA_0005_FULL_CB_80_Pin_REV_B (P500.1)
I2C_1_SCL: PCA_0005_FULL_CB_Plugs_REV_B (P107.4), PCA_0005_FULL_CB_80_Pin_REV_B (P500.37)
I2C_1_SDA: PCA_0005_FULL_CB_Plugs_REV_B (P107.5), PCA_0005_FULL_CB_80_Pin_REV_B (P500.35)
I2C_2_SCL: PCA_0005_FULL_CB_Plugs_REV_B (P102.2 P109.4), PCA_0005_FULL_CB_80_Pin_REV_B (P500.6)
I2C_2_SDA: PCA_0005_FULL_CB_Plugs_REV_B (P102.3 P109.5), PCA_0005_FULL_CB_80_Pin_REV_B (P500.4)
~{IO-LED_SAFET_PROT}: PCA_0005_FULL_CB_Plugs_REV_B (P107.7), PCA_0005_FULL_CB_80_Pin_REV_B (P500.28)
IO-CH1-PROT: PCA_0005_FULL_CB_Servo_REV_B (P304.7), PCA_0005_FULL_CB_80_Pin_REV_B (P500.80)
IO-CH2-PROT: PCA_0005_FULL_CB_Servo_REV_B (P304.8), PCA_0005_FULL_CB_80_Pin_REV_B (P500.78)
IO-CH3-PROT: PCA_0005_FULL_CB_Servo_REV_B (P304.9), PCA_0005_FULL_CB_80_Pin_REV_B (P500.76)
IO-CH4-PROT: PCA_0005_FULL_CB_Servo_REV_B (P304.10), PCA_0005_FULL_CB_80_Pin_REV_B (P500.74)
IO-CH5-PROT: PCA_0005_FULL_CB_Servo_REV_B (P304.11), PCA_0005_FULL_CB_80_Pin_REV_B (P500.72)
IO-CH6-PROT: PCA_0005_FULL_CB_Servo_REV_B (P304.12), PCA_0005_FULL_CB_80_Pin_REV_B (P500.70)
IO-CH7-PROT: PCA_0005_FULL_CB_Servo_REV_B (P304.13), PCA_0005_FULL_CB_80_Pin_REV_B (P500.68)
IO-CH8-PROT: PCA_0005_FULL_CB_Servo_REV_B (P304.14), PCA_0005_FULL_CB_80_Pin_REV_B (P500.66)
IO-SWCLK: PCA_0005_FULL_CB_Plugs_REV_B (P105.5), PCA_0005_FULL_CB_80_Pin_REV_B (P500.71)
IO-SWDIO: PCA_0005_FULL_CB_Plugs_REV_B (P105.4), PCA_0005_FULL_CB_80_Pin_REV_B (P500.69)
IO-USART1_RX_SPECTRUM_DSM: PCA_0005_FULL_CB_Plugs_REV_B (JP100.1 P105.3 SPKT100.1), PCA_0005_FULL_CB_80_Pin_REV_B (P500.48)
IO-USART1_TX: PCA_0005_FULL_CB_Plugs_REV_B (P105.2), PCA_0005_FULL_CB_80_Pin_REV_B (P500.46)
OTG_DM1: PCA_0005_FULL_CB_Power_REV_B (P201.3), PCA_0005_FULL_CB_80_Pin_REV_B (P500.33)
OTG_DP1: PCA_0005_FULL_CB_Power_REV_B (P201.2), PCA_0005_FULL_CB_80_Pin_REV_B (P500.31)
PPM-SBUS-PROT: PCA_0005_FULL_CB_Servo_REV_B (P304.15), PCA_0005_FULL_CB_80_Pin_REV_B (P500.62)
PRESSURE_SENS_IN: PCA_0005_FULL_CB_Plugs_REV_B (P101.2), PCA_0005_FULL_CB_tp_REV_B (ADC_PR.P$1), PCA_0005_FULL_CB_80_Pin_REV_B (P500.21)
RX_5V0_OUT: PCA_0005_FULL_CB_Power_REV_B (PSM200.RX), PCA_0005_FULL_CB_Servo_REV_B (P304.RX 5V)
S.BUS_OUT: PCA_0005_FULL_CB_Servo_REV_B (P301.1), PCA_0005_FULL_CB_80_Pin_REV_B (P500.64)
SAFETY: PCA_0005_FULL_CB_Plugs_REV_B (P107.6), PCA_0005_FULL_CB_80_Pin_REV_B (P500.17)
SERIAL1_CTS: PCA_0005_FULL_CB_Plugs_REV_B (P100.4), PCA_0005_FULL_CB_80_Pin_REV_B (P500.44)
SERIAL1_RTS: PCA_0005_FULL_CB_Plugs_REV_B (P100.5), PCA_0005_FULL_CB_80_Pin_REV_B (P500.42)
SERIAL1_RX: PCA_0005_FULL_CB_Plugs_REV_B (JP100.2 P100.3), PCA_0005_FULL_CB_tp_REV_B (S1RX.P$1), PCA_0005_FULL_CB_80_Pin_REV_B (P500.38)
SERIAL1_TX: PCA_0005_FULL_CB_Plugs_REV_B (P100.2), PCA_0005_FULL_CB_tp_REV_B (S1TX.P$1), PCA_0005_FULL_CB_80_Pin_REV_B (P500.40)
SERIAL2_CTS: PCA_0005_FULL_CB_Plugs_REV_B (P103.4), PCA_0005_FULL_CB_INTEL_REV_B (LV603.4), PCA_0005_FULL_CB_80_Pin_REV_B (P500.32)
SERIAL2_RTS: PCA_0005_FULL_CB_Plugs_REV_B (P103.5), PCA_0005_FULL_CB_INTEL_REV_B (LV602.4), PCA_0005_FULL_CB_80_Pin_REV_B (P500.30)
SERIAL2_RX: PCA_0005_FULL_CB_Plugs_REV_B (P103.3), PCA_0005_FULL_CB_INTEL_REV_B (LV600.4), PCA_0005_FULL_CB_tp_REV_B (S2RX.P$1), PCA_0005_FULL_CB_80_Pin_REV_B (P500.34)
SERIAL2_TX: PCA_0005_FULL_CB_Plugs_REV_B (P103.2), PCA_0005_FULL_CB_INTEL_REV_B (LV601.4), PCA_0005_FULL_CB_tp_REV_B (S2TX.P$1), PCA_0005_FULL_CB_80_Pin_REV_B (P500.36)
SERIAL3_RX: PCA_0005_FULL_CB_Plugs_REV_B (P107.3), PCA_0005_FULL_CB_tp_REV_B (S3RX.P$1), PCA_0005_FULL_CB_80_Pin_REV_B (P500.20)
SERIAL3_TX: PCA_0005_FULL_CB_Plugs_REV_B (P107.2), PCA_0005_FULL_CB_tp_REV_B (S3TX.P$1), PCA_0005_FULL_CB_80_Pin_REV_B (P500.22)
SERIAL4_RX: PCA_0005_FULL_CB_Plugs_REV_B (P109.3), PCA_0005_FULL_CB_tp_REV_B (S4RX.P$1), PCA_0005_FULL_CB_80_Pin_REV_B (P500.16)
SERIAL4_TX: PCA_0005_FULL_CB_Plugs_REV_B (P109.2), PCA_0005_FULL_CB_tp_REV_B (S4TX.P$1), PCA_0005_FULL_CB_80_Pin_REV_B (P500.18)
SERIAL5_RX: PCA_0005_FULL_CB_Plugs_REV_B (P106.3), PCA_0005_FULL_CB_Servo_REV_B (P301.4), PCA_0005_FULL_CB_tp_REV_B (S5_RX.P$1), PCA_0005_FULL_CB_80_Pin_REV_B (P500.12)
SERIAL5_TX: PCA_0005_FULL_CB_Plugs_REV_B (P106.2), PCA_0005_FULL_CB_Servo_REV_B (P301.2), PCA_0005_FULL_CB_tp_REV_B (S5_TX.P$1), PCA_0005_FULL_CB_80_Pin_REV_B (P500.14)
SPI_EXT_MISO: PCA_0005_FULL_CB_tp_REV_B (SPI_MISO1.P$1), PCA_0005_FULL_CB_80_Pin_REV_B (P500.67)
SPI_EXT_MOSI: PCA_0005_FULL_CB_tp_REV_B (SPI_MOSI1.P$1), PCA_0005_FULL_CB_80_Pin_REV_B (P500.51)
SPI_EXT_SCK: PCA_0005_FULL_CB_tp_REV_B (SPI_SCK1.P$1), PCA_0005_FULL_CB_80_Pin_REV_B (P500.73)
~{VBUS_VALID}: PCA_0005_FULL_CB_Power_REV_B (PSM200.!VBUS_VALID), PCA_0005_FULL_CB_80_Pin_REV_B (P500.59)
~{VDD_5V_HIPOWER_OC}: PCA_0005_FULL_CB_Power_REV_B (PSM200.!VDD_5V_HIPOWER_OC), PCA_0005_FULL_CB_80_Pin_REV_B (P500.45)
~{VDD_5V_PERIPH_EN}: PCA_0005_FULL_CB_Power_REV_B (PSM200.!VDD_5V_PERIPH_EN), PCA_0005_FULL_CB_80_Pin_REV_B (P500.27)
~{VDD_5V_PERIPH_OC}: PCA_0005_FULL_CB_Power_REV_B (PSM200.!VDD_5V_PERIPH_OC), PCA_0005_FULL_CB_80_Pin_REV_B (P500.43)
~{VDD_BACKUP_VALID}: PCA_0005_FULL_CB_Power_REV_B (PSM200.!VDD_BACKUP_VALID), PCA_0005_FULL_CB_80_Pin_REV_B (P500.57)
~{VDD_BRICK_VALID}: PCA_0005_FULL_CB_Power_REV_B (PSM200.!VDD_BRICK_VALID), PCA_0005_FULL_CB_80_Pin_REV_B (P500.55)
VBUS: PCA_0005_FULL_CB_Power_REV_B (P201.1 PSM200.VBUS PSM200.VDD_VBUS), PCA_0005_FULL_CB_80_Pin_REV_B (P500.29)
VDD_3V3_SPEKTRUM: PCA_0005_FULL_CB_Plugs_REV_B (D102.C SPKT100.3), PCA_0005_FULL_CB_Power_REV_B (PSM200.SPEK)
VDD_3V3_SPEKTRUM_EN: PCA_0005_FULL_CB_Power_REV_B (PSM200.VDD_3V3_SPEKTRUM_EN), PCA_0005_FULL_CB_80_Pin_REV_B (P500.19)
VDD_5V_HIPOWER: PCA_0005_FULL_CB_Plugs_REV_B (L101.P$1), PCA_0005_FULL_CB_Power_REV_B (PSM200.5V_HIPOWER), PCA_0005_FULL_CB_INTEL_REV_B (6 pins)
VDD_5V_IN_PROT: PCA_0005_FULL_CB_Power_REV_B (PSM200.VDD_5V_IN_PROT), PCA_0005_FULL_CB_80_Pin_REV_B (P500.61 P500.63)
VDD_5V_PERIPH: PCA_0005_FULL_CB_Plugs_REV_B (9 pins), PCA_0005_FULL_CB_Power_REV_B (PSM200.5V_PERIPH)
VDD_SERVO: PCA_0005_FULL_CB_Servo_REV_B (D300.ANODE P301.3 P304.SERVO VCC), PCA_0005_FULL_CB_80_Pin_REV_B (P500.53)
VDD_SERVO_IN: PCA_0005_FULL_CB_Power_REV_B (PSM200.SERVO_IN), PCA_0005_FULL_CB_Servo_REV_B (L300.P$2), PCA_0005_FULL_CB_80_Pin_REV_B (P500.9)

## Assembly variants
PCA_0005_Normal_CB: not fitted 3DR_LOGO1 3DR_LOGO2 3DR_LOGO3 ADC_PR BATT600 C600 C601 C602 C603 C604 C605 D_RDY1 EDISON600 JP400 JP401 L600 L601 LED600 LED601 LV600 LV601 LV602 LV603 LV604 LV605 M3_MOUNT901 M3_MOUNT902 M3_MOUNT903 M3_MOUNT904 Nut 600 Nut 601 P600 R600 R603 R605 R606 R607 R608 R609 R610 R611 R612 R613 S1RX S1TX S2RX S2TX S3RX S3TX S4RX S4TX S5_RX S5_TX S600 S601 S602 SPI!CS1 SPI_MISO1 SPI_MOSI1 SPI_SCK1 U601 U603 USB600 USB601
PCA_0012_INTEL_CB: not fitted EDISON600 JP400 JP401 M3_MOUNT901 M3_MOUNT902 M3_MOUNT903 M3_MOUNT904 S1RX S1TX S2RX S2TX S3RX S3TX S4RX S4TX S5_RX S5_TX